# EAGLE design CA2832 simple (EAGLE 7.1.0)
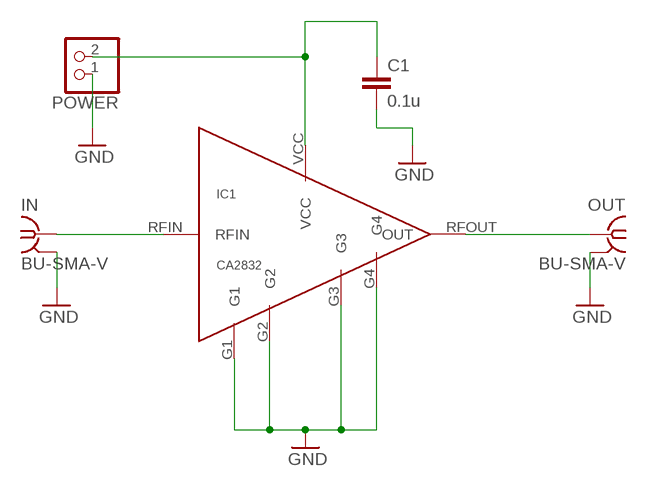
[diagram p0: schematic, sheet 1]

## Parts
C1  0.1u  C-EUC1206  [C1206]
IC1  CA2832  [714F-03]
IN  BU-SMA-V  [BU-SMA-V]
OUT  BU-SMA-V  [BU-SMA-V]
POWER  PINHD-1X2  [1X02]

## Nets
GND: C1.2 IC1.G1 IC1.G2 IC1.G3 IC1.G4 IN.2 IN.3 IN.4 IN.5 OUT.2 OUT.3 OUT.4 OUT.5 POWER.1
N$1: IC1.RFIN IN.1
N$2: IC1.RFOUT(OUT) OUT.1
VCC: C1.1 IC1.VCC POWER.2

## Library data of the parts
C1 = rcl:C-EU: CAPACITOR, European symbol
IC1 = minicircuits:CA2832: Motorola CA2832 1.6W 1-200MHz hybrid amplifier
IN OUT = con-coax:BU-SMA-V: FEMALE SMA CONNECTOR Radiall distributor RS 112-3794; OC_FARNELL: unknown; OC_NEWARK: unknown
POWER = pinhead:PINHD-1X2: PIN HEADER

## Board
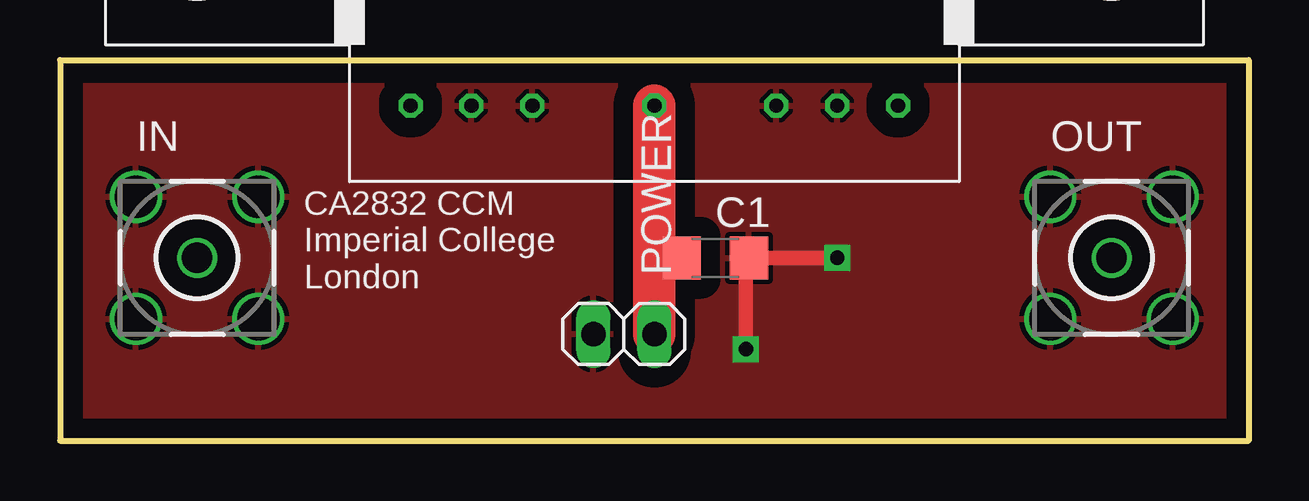
[diagram p1: board, top side]
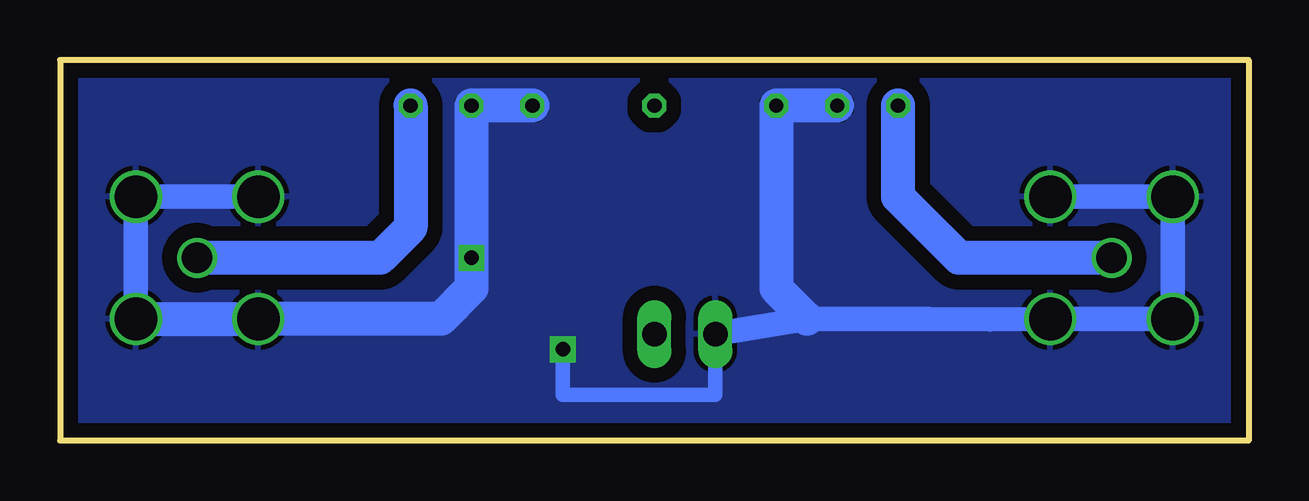
[diagram p2: board, bottom side, seen from below]

Size 49.53 x 15.88 mm. Coordinates in mm from the lower left corner, seen from the top.
Outline: 0,0 49.53,0 49.53,15.88 0,15.88 0,0
Copper layers (1*16): Top 0.035mm / dielectric 1.5mm / Bottom 0.035mm
Design rules "PCB-POOL Standard": minimum track width 0.15mm, minimum drill 0.3mm, track to track 0.15mm, track to pad 0.15mm, pad to pad 0.15mm, via to via 0.15mm, smd to smd 0.15mm, copper to edge 0.3mm, drill to drill 0.2mm, minimum pad ring 0.2mm, minimum via ring 0.15mm, stop-mask expansion 0.075mm, vias tented up to drill 0mil, thermal gap 0.2mm

### Footprints (pad centres in the part's own frame; a part is rotated, then mirrored left to right if it is on the bottom)
C1206 = smd 1.6 x 1.8: 1 -1.4,0; 2 1.4,0
714F-03 = drill 0.6 octagon: G1 -7.62,0; G2 -5.08,0; G3 5.08,0; G4 7.62,0; RFIN -10.16,0; RFOUT 10.16,0; VCC 0,0
BU-SMA-V = drill 1.27: 1 0,0 | drill 1.778: 2 -2.55,2.55; 3 2.55,2.55; 4 2.55,-2.55; 5 -2.55,-2.55
1X02 = drill 1.016 long: 1 -1.27,0; 2 1.27,0

### Placement (x,y rotation side)
C1  27.31,7.62 0 top
IC1  24.77,13.97 0 top
IN  5.71,7.62 0 top
OUT  43.81,7.62 0 top
POWER  23.5,4.45 0 top

### Tracks (layer width: path | path; a pad name or v marks a point on that pad's centre or on a via)
GND  (via drill 0.6)
  Top 0.61: v32.39,7.62 C1.2 28.57,7.49 v28.57,3.81
  Bottom 0.61: POWER.1 22.22,1.91 28.57,1.91 v28.57,3.81
  Bottom 1.016: OUT.4 OUT.3 OUT.2 | IN.3 IN.2 IN.5 IN.4 10.8,5.06 13.34,5.08 18.42,5.08 POWER.1
  Bottom 1.422: OUT.4 OUT.5 40,5.08 33.66,5.08 32.39,6.35 v32.39,7.62 IC1.G4 IC1.G3 | IC1.G1 IC1.G2 19.68,6.35 18.42,5.08
  pour Top (isolate 0.813): 0,0 0,15.88 49.53,15.88 49.53,0
  pour Bottom (isolate 0.61): 0,0 0,15.88 49.53,15.88 49.53,0
N$1
  Bottom 1.422: IN.1 12.07,7.62 14.61,10.16 IC1.RFIN
N$2
  Bottom 1.422: IC1.RFOUT 34.92,8.89 36.2,7.62 OUT.1
VCC
  Top 0.406: C1.1 24.77,7.62
  Top 1.778: POWER.2 24.77,7.62 IC1.VCC

### Text on the board
tNames: CA2832 CCM / Imperial College / London